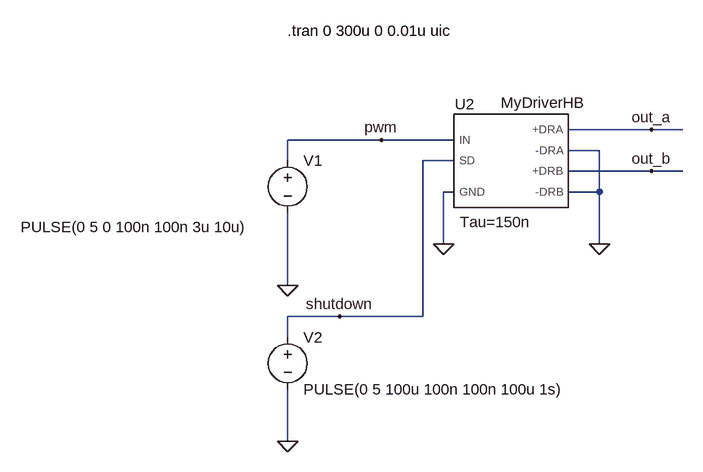
[diagram p0: schematic MyDriverHB - test0.asc]
MyDriverHB - test0.asc, the LTspice schematic file:
Version 4
SHEET 1 1872 1348
WIRE 320 480 192 480
WIRE 368 480 320 480
WIRE -96 496 -240 496
WIRE 16 496 -96 496
WIRE 240 512 192 512
WIRE -240 528 -240 496
WIRE 16 528 -32 528
WIRE 320 544 192 544
WIRE 368 544 320 544
WIRE 16 576 0 576
WIRE 240 576 240 512
WIRE 240 576 192 576
WIRE 0 656 0 576
WIRE 240 656 240 576
WIRE -240 720 -240 608
WIRE -160 768 -240 768
WIRE -32 768 -32 528
WIRE -32 768 -160 768
WIRE -240 800 -240 768
WIRE -240 960 -240 880
FLAG -240 720 0
FLAG -96 496 pwm
FLAG -240 960 0
FLAG -160 768 shutdown
FLAG 240 656 0
FLAG 320 480 out_a
FLAG 320 544 out_b
FLAG 0 656 0
SYMBOL voltage -240 512 R0
WINDOW 3 -411 118 Left 2
WINDOW 123 0 0 Left 0
WINDOW 39 0 0 Left 0
SYMATTR Value PULSE(0 5 0 100n 100n 3u 10u)
SYMATTR InstName V1
SYMBOL voltage -240 784 R0
WINDOW 123 0 0 Left 0
WINDOW 39 0 0 Left 0
SYMATTR InstName V2
SYMATTR Value PULSE(0 5 100u 100n 100n 100u 1s)
SYMBOL MyDriverHB 128 528 R0
WINDOW 123 -48 110 Bottom 2
WINDOW 0 -95 -72 Bottom 2
WINDOW 38 25 -74 Bottom 2
SYMATTR InstName U2
TEXT -240 328 Left 2 !.tran 0 300u 0 0.01u uic

The netlist it stands for:
* MyDriverHB - test0.asc
V1 pwm 0 PULSE(0 5 0 100n 100n 3u 10u)
V2 shutdown 0 PULSE(0 5 100u 100n 100n 100u 1s)
XU2 pwm shutdown 0 out_b 0 out_a 0 MyDriverHB Vcc=15 Tau=150n  ; pins IN SD -DRB +DRB -DRA +DRA GND
.tran 0 300u 0 0.01u uic
.lib MyDriverHB.sub
.backanno
.end